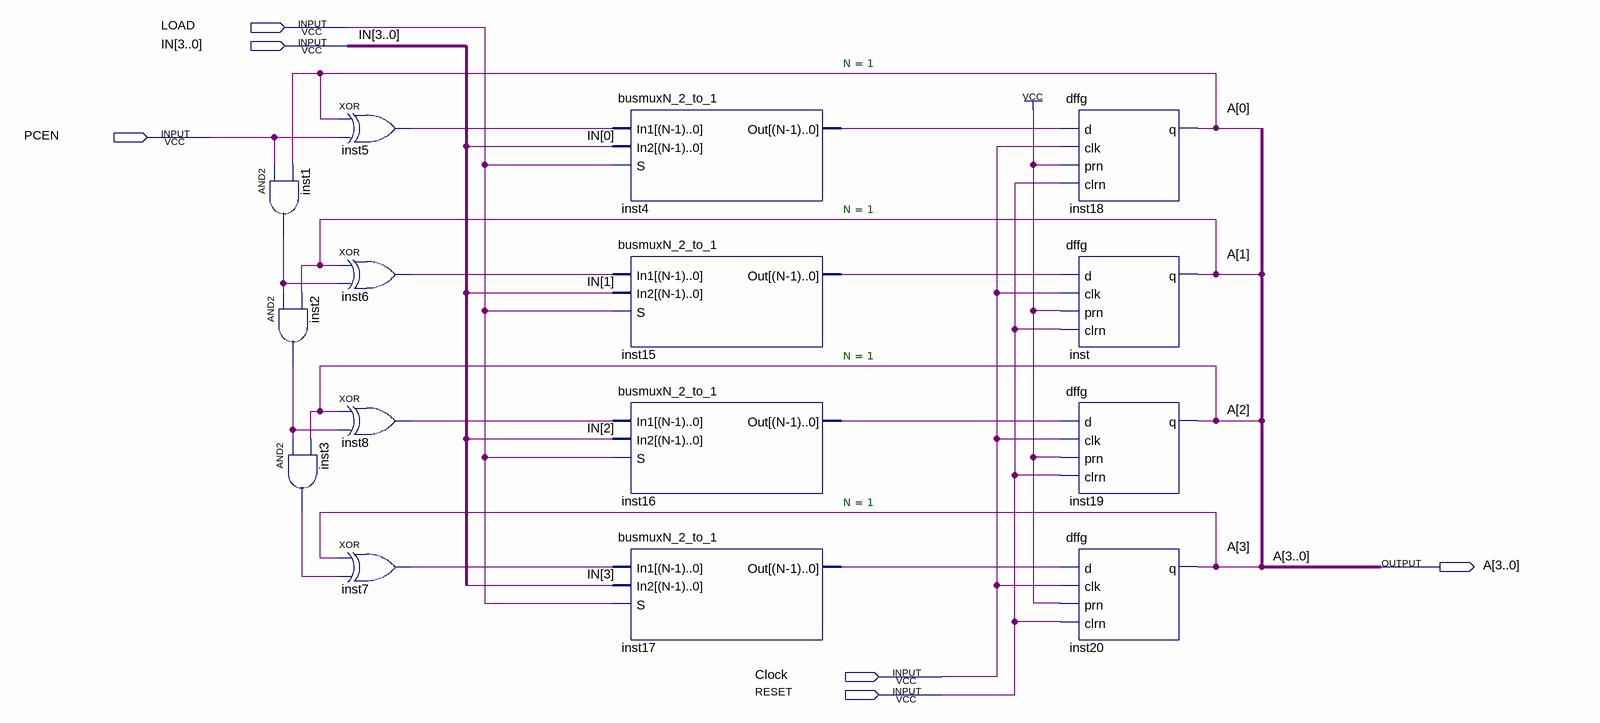
[diagram p0: schematic sheet]
// Quartus schematic PC.bdf as structural Verilog: 15 symbols, 6 pins
module PC (
  input  LOAD,
  input  [3:0] IN,
  input  PCEN,
  input  Clock,
  input  RESET,
  output [3:0] A
);

  wire inst1_out, inst2_out, inst3_out, inst4_out, inst5_out, inst6_out, inst7_out, inst8_out, inst15_out,
       inst16_out, inst17_out;

  and inst1 (inst1_out, PCEN, A[0]);
  and inst2 (inst2_out, inst1_out, A[1]);
  and inst3 (inst3_out, inst2_out, A[2]);
  xor inst5 (inst5_out, A[0], PCEN);
  xor inst6 (inst6_out, A[1], inst1_out);
  xor inst8 (inst8_out, A[2], inst2_out);
  xor inst7 (inst7_out, A[3], inst3_out);
  busmuxN_2_to_1 #(.N(1)) inst4 (.In1(inst5_out), .In2(IN[0]), .S(LOAD), .Out(inst4_out));
  busmuxN_2_to_1 #(.N(1)) inst15 (.In1(inst6_out), .In2(IN[1]), .S(LOAD), .Out(inst15_out));
  busmuxN_2_to_1 #(.N(1)) inst16 (.In1(inst8_out), .In2(IN[2]), .S(LOAD), .Out(inst16_out));
  busmuxN_2_to_1 #(.N(1)) inst17 (.In1(inst7_out), .In2(IN[3]), .S(LOAD), .Out(inst17_out));
  dffg inst18 (.d(inst4_out), .clk(Clock), .prn(1'b1), .clrn(RESET), .q(A[0]));
  dffg inst (.d(inst15_out), .clk(Clock), .prn(1'b1), .clrn(RESET), .q(A[1]));
  dffg inst19 (.d(inst16_out), .clk(Clock), .prn(1'b1), .clrn(RESET), .q(A[2]));
  dffg inst20 (.d(inst17_out), .clk(Clock), .prn(1'b1), .clrn(RESET), .q(A[3]));
endmodule
